# EAGLE design buttonboard-left (EAGLE 6.1)
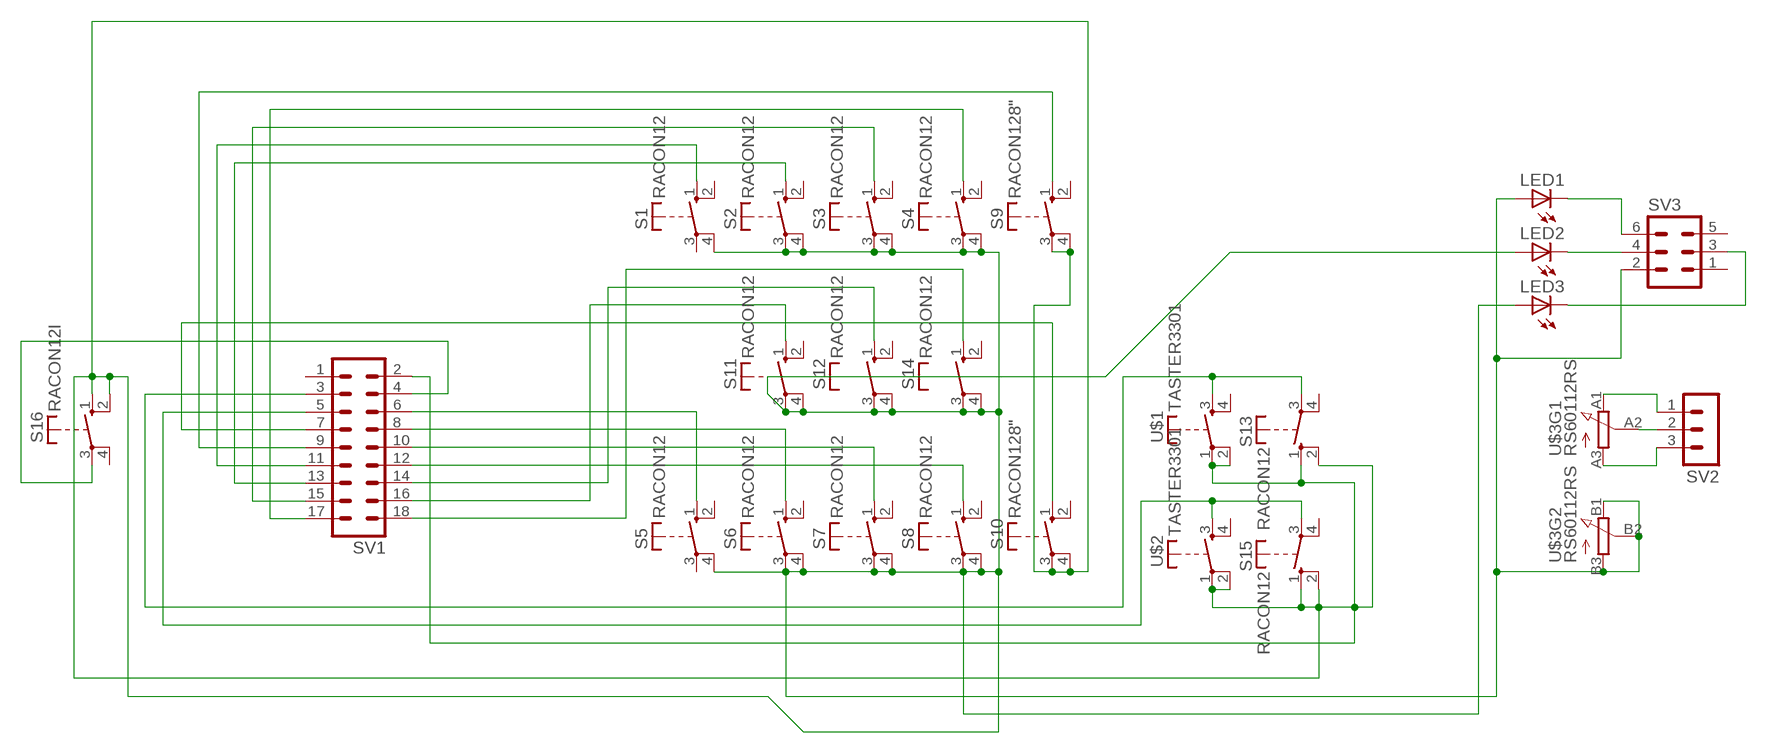
[diagram p0: schematic, sheet 1]

## Parts
LED1  LED3MM  [LED3MM]
LED2  LED3MM  [LED3MM]
LED3  LED3MM  [LED3MM]
S1  RACON12  [RACON12]
S2  RACON12  [RACON12]
S3  RACON12  [RACON12]
S4  RACON12  [RACON12]
S5  RACON12  [RACON12]
S6  RACON12  [RACON12]
S7  RACON12  [RACON12]
S8  RACON12  [RACON12]
S9  RACON128"  [RACON8]
S10  RACON128"  [RACON8]
S11  RACON12  [RACON12]
S12  RACON12  [RACON12]
S13  RACON12  [RACON12]
S14  RACON12  [RACON12]
S15  RACON12  [RACON12]
S16  RACON12I  [RACON12I]
SV1  MA09-2  [MA09-2]
SV2  MA03-1  [MA03-1]
SV3  MA03-2  [MA03-2]
U$1  TASTER3301  [3301]
U$2  TASTER3301  [3301]
U$3  RS60112RS  [RS60112]

## Nets
GND: LED1.A LED2.A LED3.A S1.4(P) S2.3(P) S2.4(P) S3.3(P) S3.4(P) S4.3(P) S4.4(P) S5.4(P) S6.3(P) S6.4(P) S7.3(P) S7.4(P) S8.3(P) S8.4(P) S9.3(P) S9.4(P) S10.3(P) S10.4(P) S11.3(P) S11.4(P) S12.3(P) S12.4(P) S13.1(S) S13.2(S) S14.3(P) S14.4(P) S15.1(S) S15.2(S) S16.1(S) S16.2(S) SV1.2 SV3.2 U$1.1(P) U$1.2(P) U$2.1(P) U$2.2(P) U$3.B1(E) U$3.B2(S) U$3.B3(A)
N$1: S10.1(S) SV1.7
N$2: S1.1(S) SV1.11
N$3: S6.1(S) SV1.8
N$4: S2.1(S) SV1.13
N$5: S7.1(S) SV1.10
N$6: S8.1(S) SV1.12
N$7: S5.1(S) SV1.6
N$8: S15.3(P) SV1.5 U$2.3(S)
N$9: S3.1(S) SV1.15
N$10: S13.3(P) SV1.3 U$1.3(S)
N$11: LED1.K(C) SV3.6
N$12: LED2.K(C) SV3.4
N$13: LED3.K(C) SV3.3
N$14: S4.1(S) SV1.17
N$15: SV2.2 U$3.A2(S)
N$16: SV2.1 U$3.A1(E)
N$17: SV2.3 U$3.A3(A)
N$18: S16.3(P) SV1.4
N$19: S12.1(S) SV1.14
N$20: S9.1(S) SV1.9
N$34: S11.1(S) SV1.16
N$35: S14.1(S) SV1.18
Unconnected: S1.2(S) S1.3(P) S2.2(S) S3.2(S) S4.2(S) S5.2(S) S5.3(P) S6.2(S) S7.2(S) S8.2(S) S9.2(S) S10.2(S) S11.2(S) S12.2(S) S13.4(P) S14.2(S) S15.4(P) S16.4(P) SV1.1 SV3.1 SV3.5 U$1.4(S) U$2.4(S)

## Library data of the parts
LED1-LED3 = led:LED: LED OSRAM: - CHIPLED LG R971, LG N971, LY N971, LG Q971, LY Q971, LO R971, LY R971 LH N974, LH R974 LS Q976, LO Q976, LY Q976 LO Q996 - Hyper CHIPLED LW Q18S LB Q993, LB Q99A, LB R99A - SideLED LS A670, LO A670, LY A670, LG A670, LP A670 LB A673, LV A673, LT A673, LW A673 LH A674 LY A675 LS A676, LA A676, LO A676, LY A676, LW A676 LS A679, LY A679, LG A679 - Hyper Micro SIDELED® LS Y876, LA Y876, LO Y876, LY Y876 LT Y87S - SmartLED LW L88C, LW L88S LB L89C, LB L89S, LG L890 LS L89K, LO L89K, LY L89K LS L896, LA L896, LO L896, LY L896 - TOPLED LS T670, LO T670, LY T670, LG T670, LP T670 LSG T670, LSP T670, LSY T670, LOP T670, LYG T670 LG T671, LOG T671, LSG T671 LB T673, LV T673, LT T673, LW T673 LH T674 LS T676, LA T676, LO T676, LY T676, LB T676, LH T676, LSB T676, LW T676 LB T67C, LV T67C, LT T67C, LS T67K, LO T67K, LY T67K, LW E67C LS E67B, LA E67B, LO E67B, LY E67B, LB E67C, LV E67C, LT E67C LW T67C LS T679, LY T679, LG T679 LS T770, LO T770, LY T770, LG T770, LP T770 LB T773, LV T773, LT T773, LW T773 LH T774 LS E675, LA E675, LY E675, LS T675 LS T776, LA T776, LO T776, LY T776, LB T776 LHGB T686 LT T68C, LB T68C - Hyper Mini TOPLED® LB M676 - Mini TOPLED Santana® LG M470 LS M47K, LO M47K, LY M47K Source: http://www.osram.convergy.de LUXEON: - LUMILED® LXK2-PW12-R00, LXK2-PW12-S00, LXK2-PW14-U00, LXK2-PW14-V00 LXK2-PM12-R00, LXK2-PM12-S00, LXK2-PM14-U00 LXK2-PE12-Q00, LXK2-PE12-R00, LXK2-PE12-S00, LXK2-PE14-T00, LXK2-PE14-U00 LXK2-PB12-K00, LXK2-PB12-L00, LXK2-PB12-M00, LXK2-PB14-N00, LXK2-PB14-P00, LXK2-PB14-Q00 LXK2-PR12-L00, LXK2-PR12-M00, LXK2-PR14-Q00, LXK2-PR14-R00 LXK2-PD12-Q00, LXK2-PD12-R00, LXK2-PD12-S00 LXK2-PH12-R00, LXK2-PH12-S00 LXK2-PL12-P00, LXK2-PL12-Q00, LXK2-PL12-R00 Source: www.luxeon.com KINGBRIGHT: KA-3528ASYC Source: www.kingbright.com
S1-S16 = switch-misc:RACON12: ITT SWITCH
SV1 = con-lstb:MA09-2: PIN HEADER; OC_FARNELL: unknown; OC_NEWARK: unknown
SV2 = con-lstb:MA03-1: PIN HEADER; OC_FARNELL: unknown; OC_NEWARK: unknown
SV3 = con-lstb:MA03-2: PIN HEADER; OC_FARNELL: unknown; OC_NEWARK: unknown
U$1 U$2 = switch-misc:TASTER3301: Simple Button, small size. REICHELT TASTER 3301
U$3 = pot:RS60112

## Board
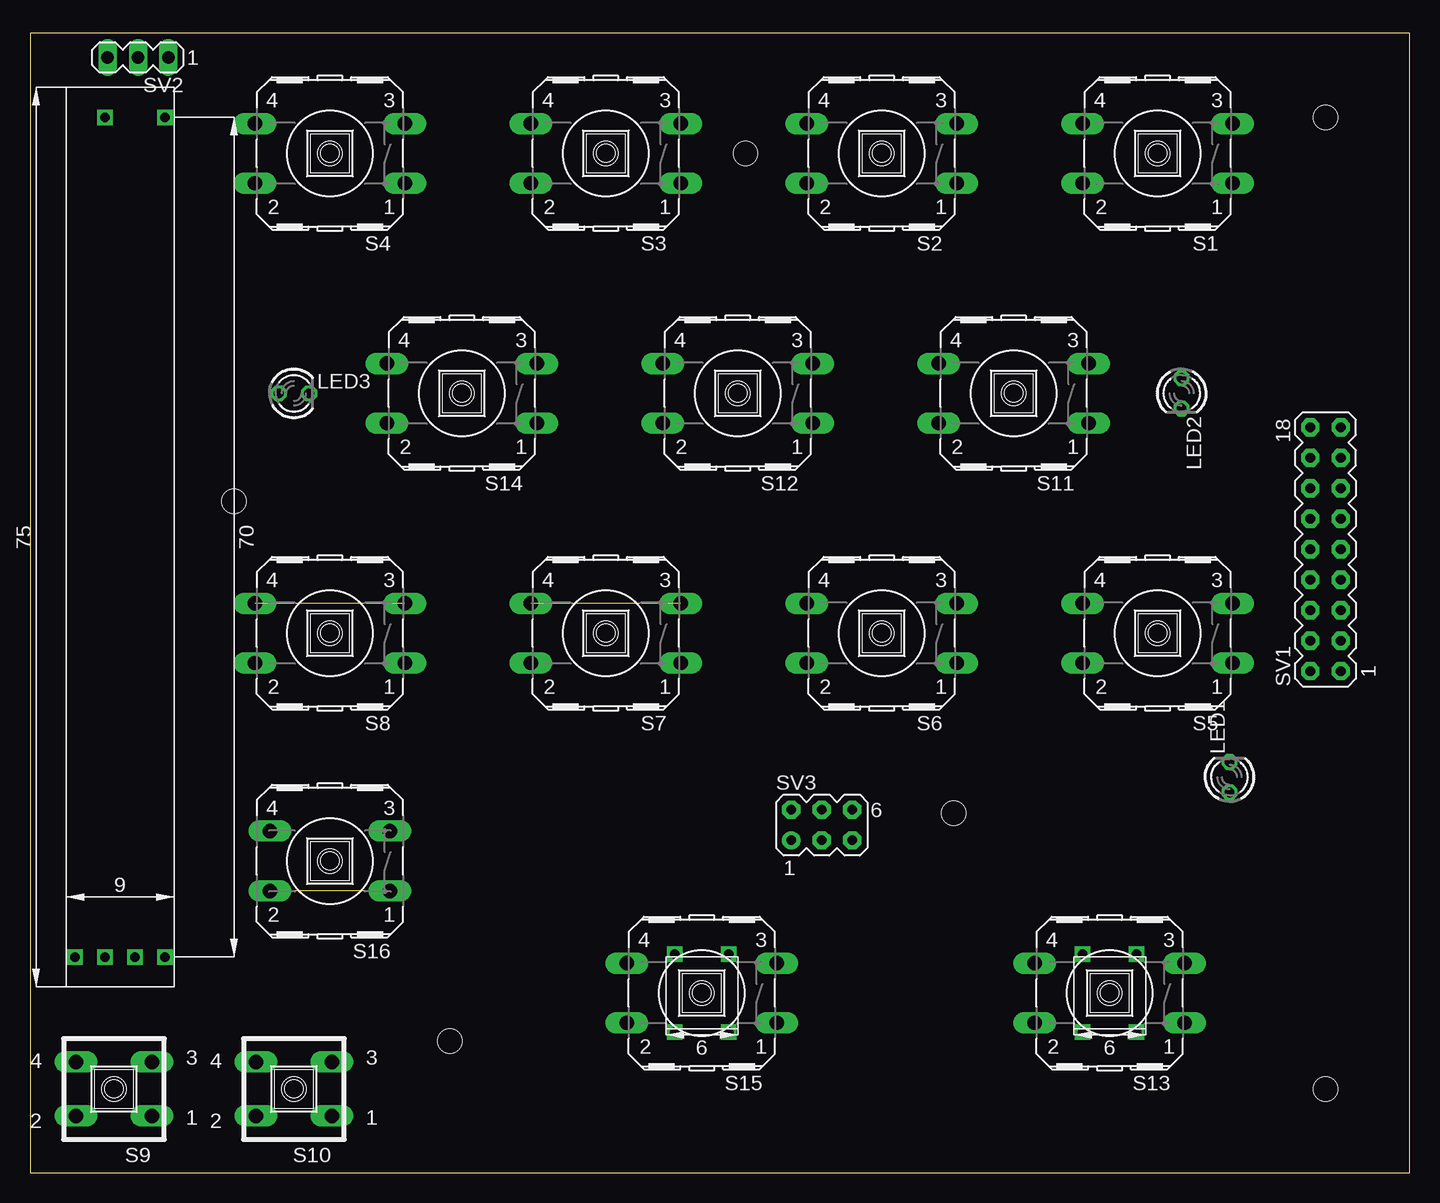
[diagram p1: board, top side]
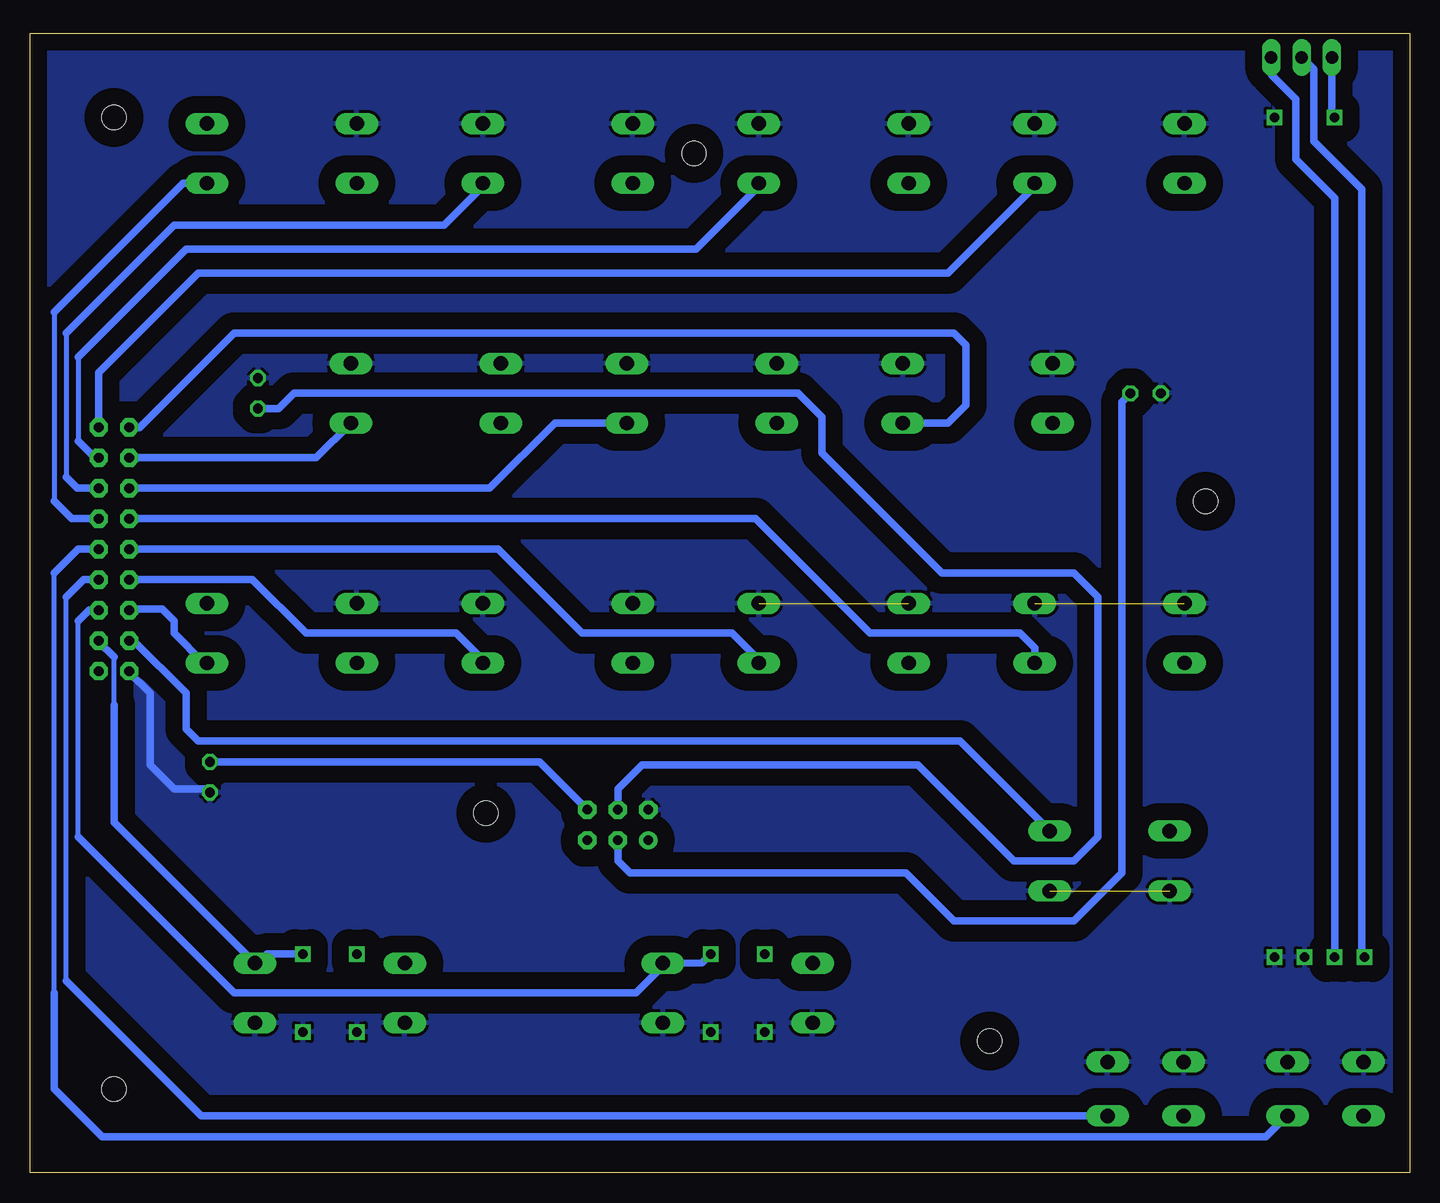
[diagram p2: board, bottom side, seen from below]

Size 115 x 95 mm. Coordinates in mm from the lower left corner, seen from the top.
Outline: 0,0 115,0 115,95 0,95 0,0
Copper layers (1*16): Top 0.035mm / dielectric 1.5mm / Bottom 0.035mm
Design rules: minimum track width 10mil, minimum drill 24mil, track to track 8mil, track to pad 8mil, pad to pad 8mil, via to via 8mil, smd to smd 8mil, copper to edge 40mil, drill to drill 8mil, minimum pad ring 10mil, minimum via ring 8mil, stop-mask expansion 4mil, vias tented up to drill 0mil, thermal gap 10mil
Holes 2 mm at 108,7 108,88 77,30 17,56 35,11 59.63,85

### Footprints (pad centres in the part's own frame; a part is rotated, then mirrored left to right if it is on the bottom)
LED3MM = drill 0.813 octagon: A -1.27,0; K 1.27,0
RACON12 = drill 1.194 long: 1 -6.248,2.489; 2 6.248,2.489; 3 -6.248,-2.489; 4 6.248,-2.489
RACON8 = drill 1.194 long: 1 -3.175,2.25; 2 3.175,2.25; 3 -3.175,-2.25; 4 3.175,-2.25
RACON12I = drill 1.194 long: 1 -5,2.5; 2 5,2.5; 3 -5,-2.5; 4 5,-2.5
MA09-2 = drill 0.8 pad 1.524 octagon: 1 -10.16,-1.27; 2 -10.16,1.27; 3 -7.62,-1.27; 4 -7.62,1.27; 5 -5.08,-1.27; 6 -5.08,1.27; 7 -2.54,-1.27; 8 -2.54,1.27; 9 0,-1.27; 10 0,1.27; 11 2.54,-1.27; 12 2.54,1.27; 13 5.08,-1.27; 14 5.08,1.27; 15 7.62,-1.27; 16 7.62,1.27; 17 10.16,-1.27; 18 10.16,1.27
MA03-1 = drill 1.016 long: 1 -2.54,0; 2 0,0; 3 2.54,0
MA03-2 = drill 0.8 pad 1.524: 1 -2.54,-1.27 | drill 0.8 pad 1.524 octagon: 2 -2.54,1.27; 3 0,-1.27; 4 0,1.27; 5 2.54,-1.27; 6 2.54,1.27
3301 = drill 0.8 square: 1 -2.25,3.25; 2 2.25,3.25; 3 -2.25,-3.25; 4 2.25,-3.25
RS60112 = drill 0.8 square: A1 -35,1.25; A2 -35,3.75; A3 35,1.25; B1 -35,-3.75; B2 -35,-1.25; B3 35,-3.75

### Placement (x,y rotation side)
LED1  100,33 90 top
LED2  96,65 270 top
LED3  22,65 0 top
S1  94,85 180 top
S2  71,85 180 top
S3  48,85 180 top
S4  25,85 180 top
S5  94,45 180 top
S6  71,45 180 top
S7  48,45 180 top
S8  25,45 180 top
S9  7,7 180 top
S10  22,7 180 top
S11  82,65 180 top
S12  59,65 180 top
S13  90,15 180 top
S14  36,65 180 top
S15  56,15 180 top
S16  25,26 180 top
SV1  108,52 90 top
SV2  9,93 180 top
SV3  66,29 0 top
U$1  90,15 180 top
U$2  56,15 180 top
U$3  7.5,53 90 top

### Tracks (layer width: path | path; a pad name or v marks a point on that pad's centre or on a via)
GND  (3 unrouted)
  Bottom 0.61: LED1.A 100.27,32 103,32 105,34 105,40 106.73,41.73 SV1.2
  pour Bottom (isolate 1.422): -1,96 116,96 116,-1 -1,-1
N$1
  Bottom 0.406: 112,16 112,48
  Bottom 0.61: 112,48 110.54,49.46 SV1.7 | 112,16 100.75,4.75 S10.1
N$2
  Bottom 0.406: 113,71.76 113,56
  Bottom 0.61: 113,56 111.54,54.54 SV1.11 | 113,71.76 102.25,82.51 S1.1
N$3
  Bottom 0.61: SV1.8 96.46,49.46 92,45 79.5,45 77.25,42.75 S6.1
N$4
  Bottom 0.406: 112,70 112,58
  Bottom 0.61: 112,70 103,79 80.5,79 77.25,82.25 S2.1 | 112,58 111.08,57.08 SV1.13
N$5
  Bottom 0.61: SV1.10 76,52 69,45 56.5,45 54.25,42.75 S7.1
N$6
  Bottom 0.61: SV1.12 54.54,54.54 45,45 32.5,45 31.25,43.75 S8.1
N$7
  Bottom 0.61: S5.1 100.51,42.51 103,45 103,46 104,47 106.65,47 SV1.6
N$8
  Bottom 0.406: 111,28 111,46
  Bottom 0.61: 111,28 98,15 64.5,15 62.25,17.25 S15.3 59,17.5 U$2.3 | 111,46 110.08,46.92 SV1.5
N$9
  Bottom 0.406: 111,68 111,61
  Bottom 0.61: 111,68 102,77 59.5,77 54.25,82.25 S3.1 | 111,61 109.62,59.62 SV1.15
N$10
  Bottom 0.406: 108,39 108,43
  Bottom 0.61: 108,39 108,29.24 S13.3 95.25,18.25 U$1.3 | 108,43 109.27,44.27 SV1.3
N$11
  Bottom 0.61: LED1.K 72.54,34.27 SV3.6
N$12
  Bottom 0.61: LED2.K 94.27,63.73 93,65 51,65 49,63 49,60 39,50 28,50 26,48 26,28 28,26 33,26 41,34 64,34 66,32 SV3.4
N$13
  Bottom 0.61: LED3.K 24,64.27 24,25 28,21 38,21 42,25 65,25 66,26 SV3.3
N$14
  Bottom 0.61: SV1.17 109.27,66.73 101,75 38.5,75 31.25,82.25 S4.1
N$15
  Bottom 0.61: U$3.A2 4,18 4,82 8,86 8,92 SV2.2
N$16
  Bottom 0.61: U$3.A1 6.25,81.25 9.5,84.5 9.5,89.5 11.5,91.5 11.5,92.96 SV2.1
N$17
  Bottom 0.61: U$3.A3 6.46,88 SV2.3
N$18
  Bottom 0.61: SV1.4 106.38,44.38 102,40 102,37 101,36 37.5,36 S16.3
N$19
  Bottom 0.61: SV1.14 76.68,57.08 71.25,62.51 S12.1
N$20
  Bottom 0.406: 113,15 113,50
  Bottom 0.61: 113,15 113,7 109,3 12,3 10.25,4.75 S9.1 | 113,50 111,52 SV1.9
N$34
  Bottom 0.61: SV1.16 91.14,59.62 S11.1
N$35
  Bottom 0.61: SV1.18 105.84,62.16 98,70 38,70 37,69 37,64 38.5,62.5 S14.1